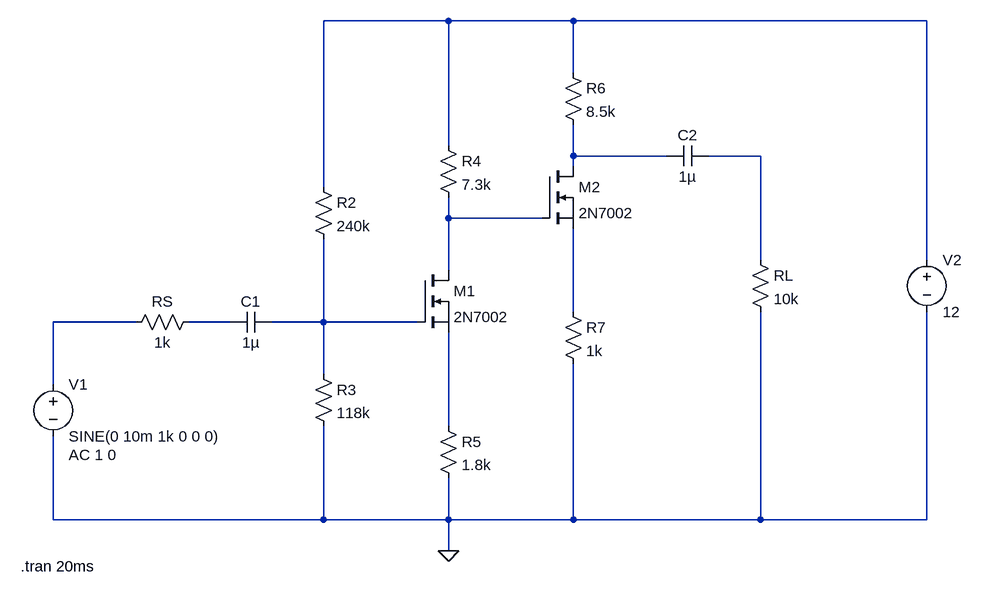
[diagram p0: schematic multistage_amplifier.asc]
multistage_amplifier.asc, the LTspice schematic file:
Version 4
SHEET 1 1352 680
WIRE 160 -384 -32 -384
WIRE 352 -384 160 -384
WIRE 896 -384 352 -384
WIRE 352 -304 352 -384
WIRE 160 -192 160 -384
WIRE 352 -176 352 -224
WIRE 496 -176 352 -176
WIRE 640 -176 560 -176
WIRE 352 -160 352 -176
WIRE -32 -128 -32 -384
WIRE 160 -80 160 -112
WIRE 304 -80 160 -80
WIRE 640 -16 640 -176
WIRE 896 -16 896 -384
WIRE 160 0 160 -80
WIRE 352 64 352 -64
WIRE -320 80 -448 80
WIRE -176 80 -240 80
WIRE -32 80 -32 -48
WIRE -32 80 -112 80
WIRE 112 80 -32 80
WIRE -32 160 -32 80
WIRE -448 176 -448 80
WIRE 160 240 160 96
WIRE -448 384 -448 256
WIRE -32 384 -32 240
WIRE -32 384 -448 384
WIRE 160 384 160 320
WIRE 160 384 -32 384
WIRE 352 384 352 144
WIRE 352 384 160 384
WIRE 640 384 640 64
WIRE 640 384 352 384
WIRE 896 384 896 64
WIRE 896 384 640 384
WIRE 160 432 160 384
FLAG 160 432 0
SYMBOL voltage -448 160 R0
WINDOW 123 24 124 Left 2
WINDOW 39 0 0 Left 0
SYMATTR Value2 AC 1 0
SYMATTR InstName V1
SYMATTR Value SINE(0 10m 1k 0 0 0)
SYMBOL voltage 896 -32 R0
WINDOW 123 0 0 Left 0
WINDOW 39 0 0 Left 0
SYMATTR InstName V2
SYMATTR Value 12
SYMBOL nmos 112 0 R0
SYMATTR InstName M1
SYMATTR Value 2N7002
SYMBOL nmos 304 -160 R0
SYMATTR InstName M2
SYMATTR Value 2N7002
SYMBOL res -224 64 R90
WINDOW 0 0 56 VBottom 2
WINDOW 3 32 56 VTop 2
SYMATTR InstName RS
SYMATTR Value 1k
SYMBOL res -48 -144 R0
SYMATTR InstName R2
SYMATTR Value 240k
SYMBOL res -48 144 R0
SYMATTR InstName R3
SYMATTR Value 118k
SYMBOL res 144 -208 R0
SYMATTR InstName R4
SYMATTR Value 7.3k
SYMBOL res 144 224 R0
SYMATTR InstName R5
SYMATTR Value 1.8k
SYMBOL res 336 -320 R0
SYMATTR InstName R6
SYMATTR Value 8.5k
SYMBOL res 336 48 R0
SYMATTR InstName R7
SYMATTR Value 1k
SYMBOL res 624 -32 R0
SYMATTR InstName RL
SYMATTR Value 10k
SYMBOL cap -112 64 R90
WINDOW 0 0 32 VBottom 2
WINDOW 3 32 32 VTop 2
SYMATTR InstName C1
SYMATTR Value 1µ
SYMBOL cap 560 -192 R90
WINDOW 0 0 32 VBottom 2
WINDOW 3 32 32 VTop 2
SYMATTR InstName C2
SYMATTR Value 1µ
TEXT -498 456 Left 2 !.tran 20ms

The netlist it stands for:
* multistage_amplifier.asc
V1 N006 0 SINE(0 10m 1k 0 0 0) AC 1 0
V2 N001 0 12
M1 N004 N008 N009 N009 2N7002
M2 N002 N004 N005 N005 2N7002
RS N007 N006 1k
R2 N001 N008 240k
R3 N008 0 118k
R4 N001 N004 7.3k
R5 N009 0 1.8k
R6 N001 N002 8.5k
R7 N005 0 1k
RL N003 0 10k
C1 N008 N007 1µ
C2 N003 N002 1µ
.model NMOS NMOS
.model PMOS PMOS
.lib standard.mos
.tran 20ms
.backanno
.end